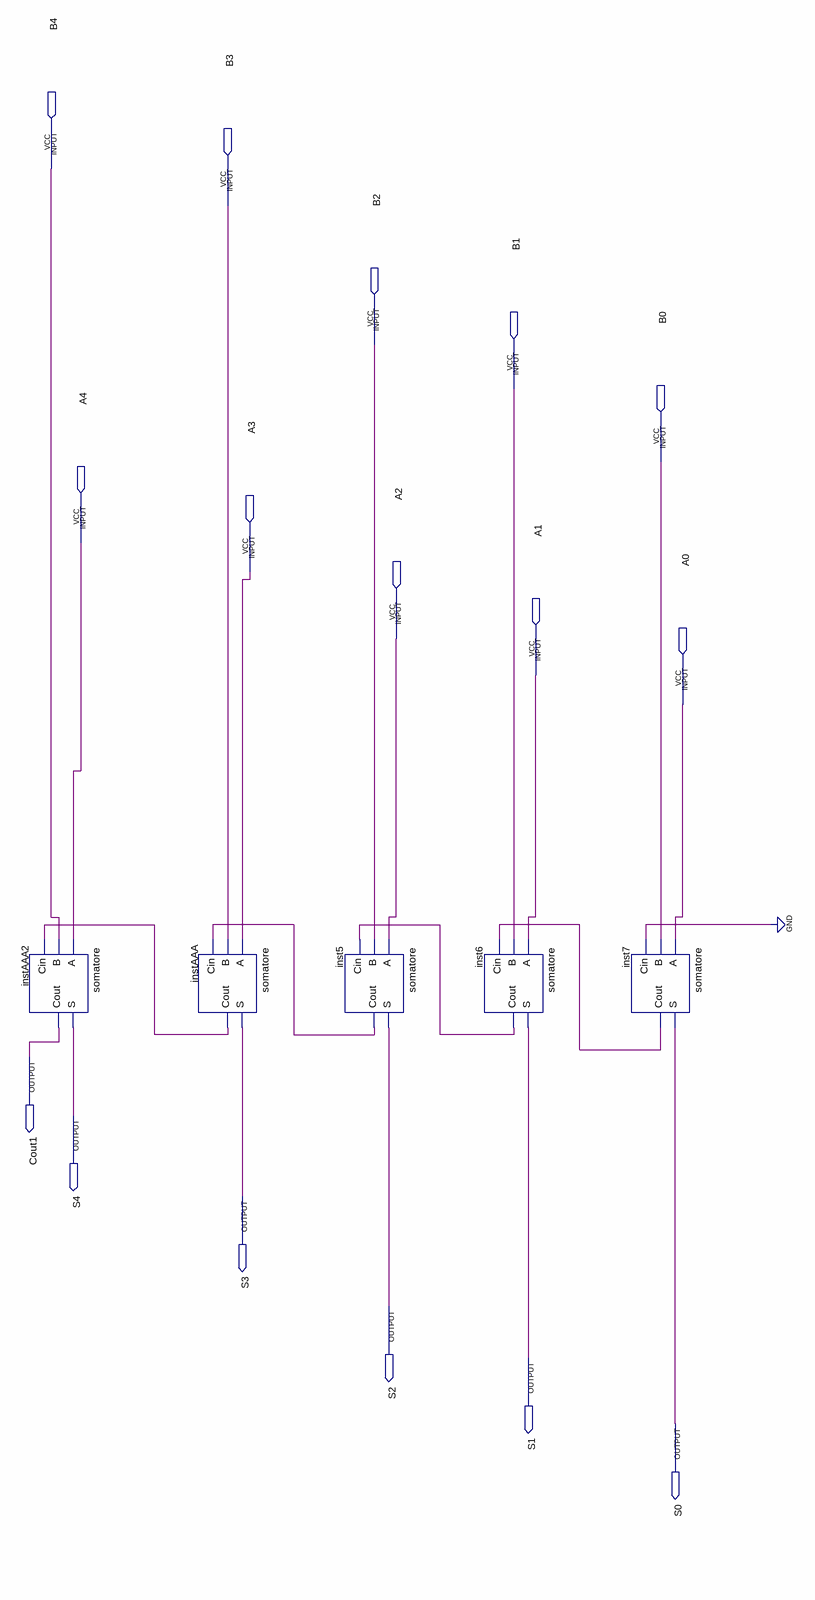
[diagram p0: schematic sheet]
// Quartus schematic somatore4.bdf as structural Verilog: 5 symbols, 16 pins
module somatore4 (
  input  B4,
  input  B3,
  input  B2,
  input  B1,
  input  B0,
  input  A4,
  input  A3,
  input  A2,
  input  A1,
  input  A0,
  output Cout1,
  output S4,
  output S3,
  output S2,
  output S1,
  output S0
);

  wire inst5_cout, inst6_cout, inst7_cout, instAAA_cout;

  somatore instAAA2 (.A(A4), .B(B4), .Cin(instAAA_cout), .S(S4), .Cout(Cout1));
  somatore instAAA (.A(A3), .B(B3), .Cin(inst5_cout), .S(S3), .Cout(instAAA_cout));
  somatore inst5 (.A(A2), .B(B2), .Cin(inst6_cout), .S(S2), .Cout(inst5_cout));
  somatore inst6 (.A(A1), .B(B1), .Cin(inst7_cout), .S(S1), .Cout(inst6_cout));
  somatore inst7 (.A(A0), .B(B0), .Cin(1'b0), .S(S0), .Cout(inst7_cout));
endmodule
